# EAGLE schematic powersupplyboardinprogress (EAGLE 8.5.2)
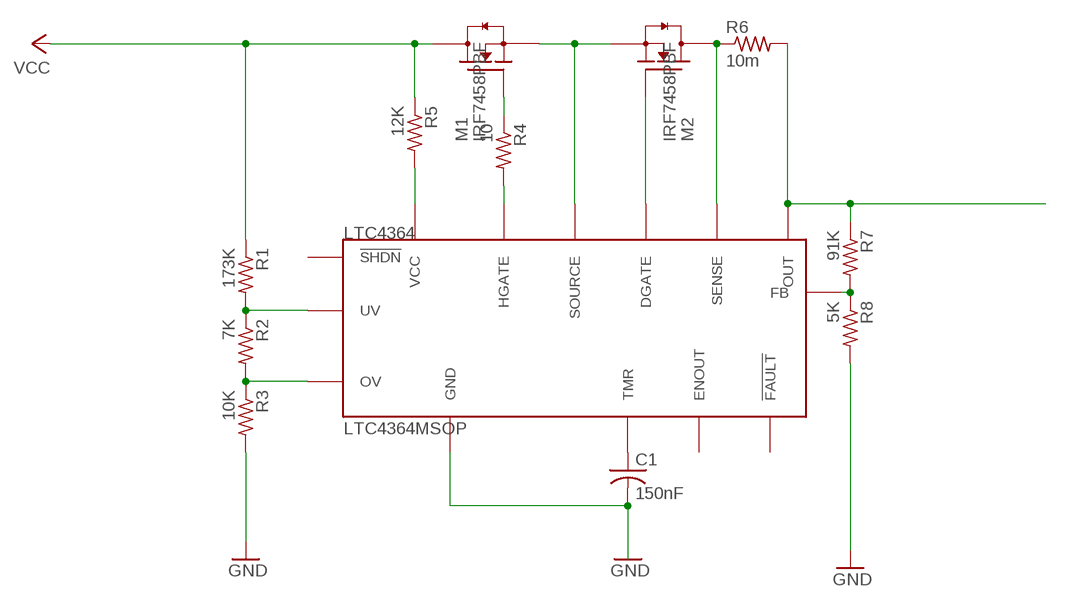
[diagram p0: schematic, sheet 1]

## Parts
C1  150nF  C-USC0805  [C0805]
LTC4364  LTC4364MSOP  [MSOP16]
M1  IRF7458PBF  [SOIC8]
M2  IRF7458PBF  [SOIC8]
R1  173K  R-US_R0805  [R0805]
R2  7K  R-US_R0805  [R0805]
R3  10K  R-US_R0805  [R0805]
R4  10  R-US_R0805  [R0805]
R5  12K  R-US_R0805  [R0805]
R6  10m  R-US_R0805  [R0805]
R7  91K  R-US_R0805  [R0805]
R8  5K  R-US_R0805  [R0805]

## Nets
GND: C1.2 LTC4364.GND R3.2 R8.2
N$1: LTC4364.DGATE M2.G1(G)
N$2: LTC4364.SOURCE M1.S1(S) M1.S2(S) M1.S3(S) M2.S1(S) M2.S2(S) M2.S3(S)
N$3: C1.1 LTC4364.TMR
N$4: LTC4364.UV R1.2 R2.1
N$5: LTC4364.OV R2.2 R3.1
N$6: M1.G1(G) R4.1
N$7: LTC4364.FB R7.2 R8.1
N$8: LTC4364.HGATE R4.2
N$9: LTC4364.OUT R6.2 R7.1
N$10: LTC4364.VCC R5.2
N$11: LTC4364.SENSE M2.D1(D) M2.D2(D) M2.D3(D) M2.D4(D) R6.1
VCC: M1.D1(D) M1.D2(D) M1.D3(D) M1.D4(D) R1.1 R5.1
Unconnected: LTC4364.ENOUT LTC4364.FLT(!FAULT!) LTC4364.SHDN(!SHDN!)

## Library data of the parts
C1 = resistor:C-US: CAPACITOR, American symbol; SPICEPREFIX: C
LTC4364 = linear:LTC4364; SPICEPREFIX: X
M1 M2 = transistor-fet:IRF7458PBF: N-Channel Enhancement Type MOSFET; SPICEPREFIX: M
R1-R8 = resistor:R-US_: RESISTOR, American symbol